# EAGLE design mother_card_17 (EAGLE 8.3.2)

## Sheet 1 of 2
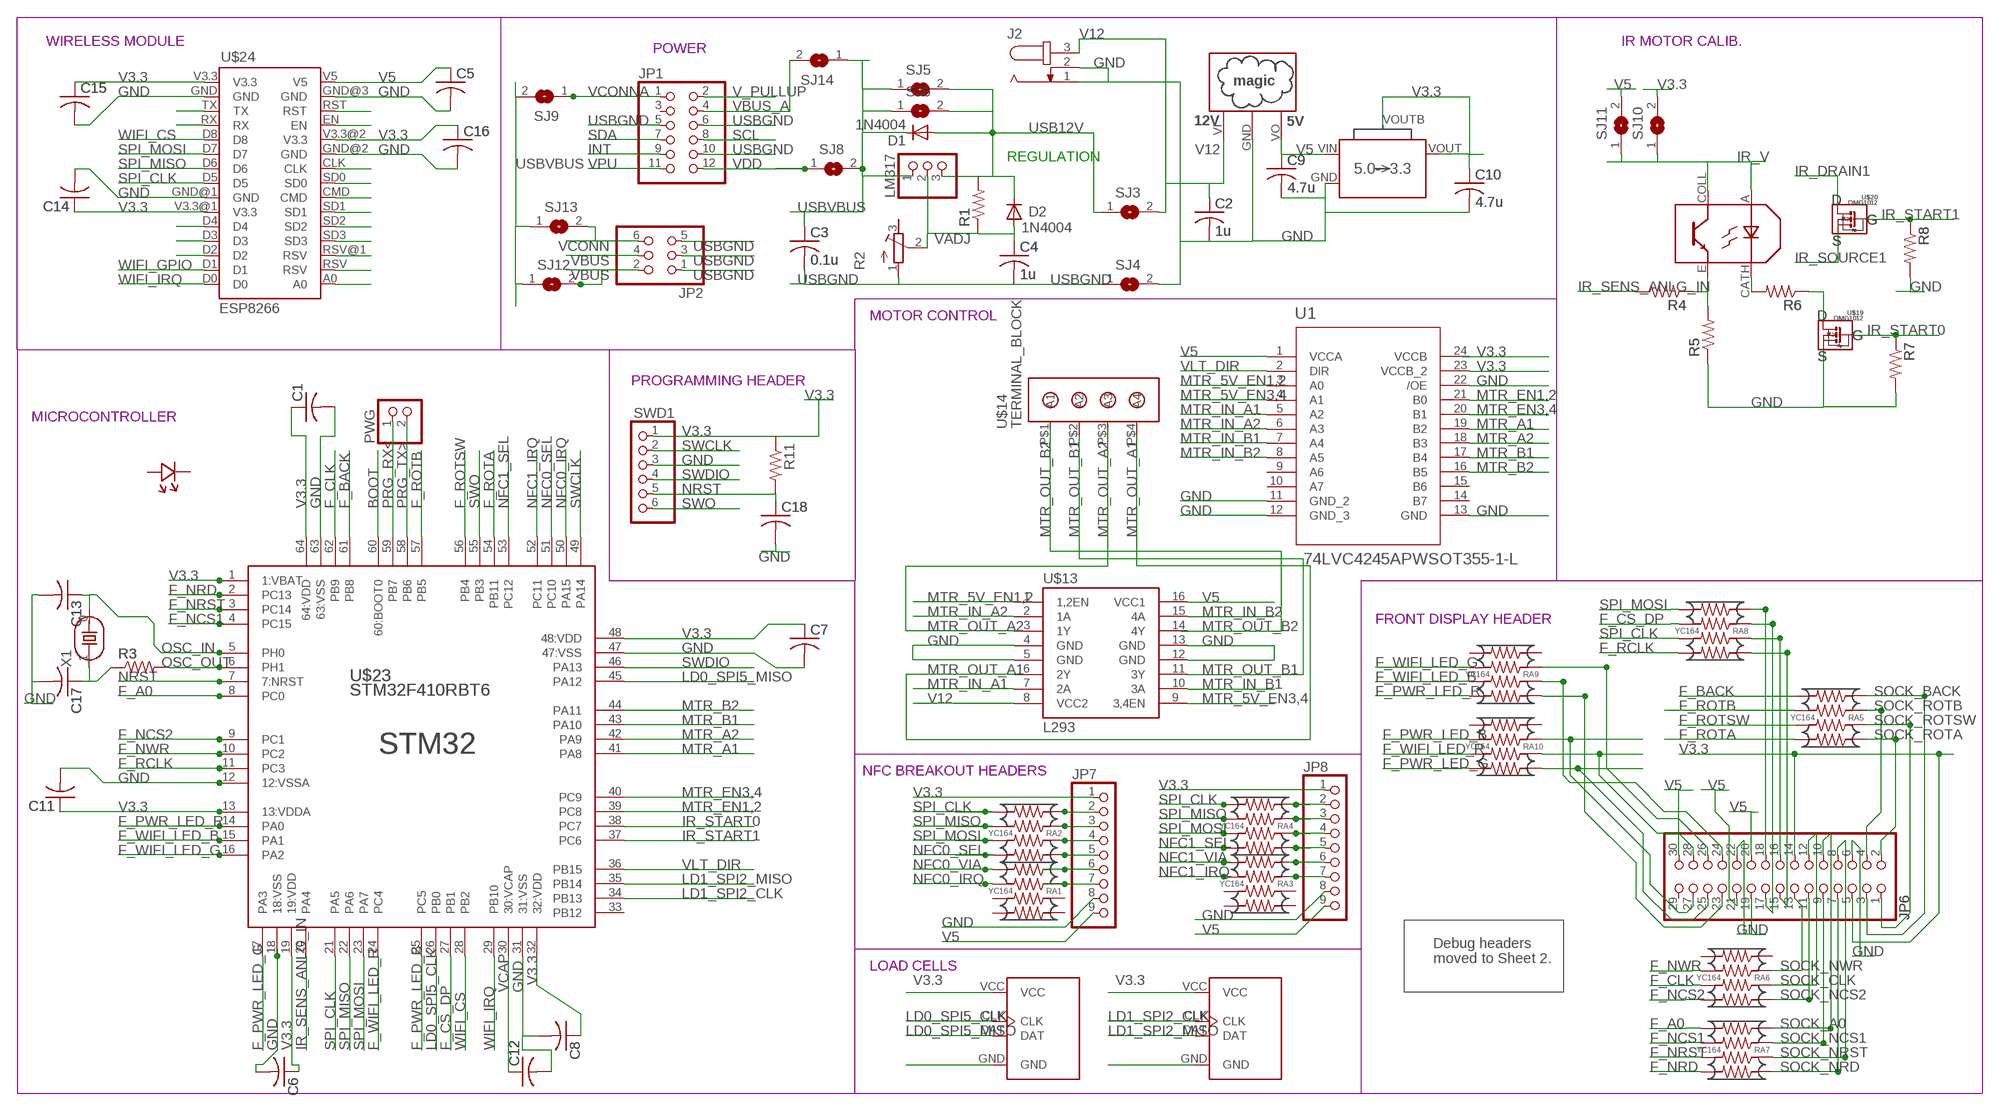
[diagram p0: schematic, sheet 1]

### Parts
C1  C-USC0805  [C0805]
C2  1u  C-USC0805  [C0805]
C3  0.1u  C-USC0805  [C0805]
C4  1u  C-USC0805  [C0805]
C5  C-USC0805  [C0805]
C6  C-USC0805  [C0805]
C7  C-USC0805  [C0805]
C8  C-USC0805  [C0805]
C9  4.7u  C-USC0805  [C0805]
C10  4.7u  C-USC0805  [C0805]
C11  C-USC0805  [C0805]
C12  C-USC0805  [C0805]
C13  C-USC0603  [C0603]
C14  C-USC0805  [C0805]
C15  C-USC0805  [C0805]
C16  C-USC0805  [C0805]
C17  C-USC0603  [C0603]
C18  C-USC0805  [C0805]
D1  1N4004  [DO41-10]
D2  1N4004  [DO41-10]
J2  JACK-PLUG0  [SPC4077]
JP1  PINHD-2X6  [2X06]
JP2  PINHD-2X3  [2X03]
JP6  PINHD-2X15/SOCK  [2X15/SOCK]
JP7  PINHD-1X9/90  [1X09/90]
JP8  PINHD-1X9/90  [1X09/90]
LM317  PINHD-1X3  [1X03]
PWG  PINHD-1X2  [1X02]
R1  R-US_R0805  [R0805]
R2  R-TRIMM64W  [RTRIM64W]
R3  R-US_R0805  [R0805]
R4  R-US_R0805  [R0805]
R5  R-US_R0805  [R0805]
R6  R-US_R0805  [R0805]
R7  R-US_R0805  [R0805]
R8  R-US_R0805  [R0805]
R11  R-US_R0805  [R0805]
RA1  YC164  [YC164]
RA2  YC164  [YC164]
RA3  YC164  [YC164]
RA4  YC164  [YC164]
RA5  YC164  [YC164]
RA6  YC164  [YC164]
RA7  YC164  [YC164]
RA8  YC164  [YC164]
RA9  YC164  [YC164]
RA10  YC164  [YC164]
SJ3  SJ  [SJ]
SJ4  SJ  [SJ]
SJ5  SJ  [SJ]
SJ6  SJ  [SJ]
SJ8  SJ  [SJ]
SJ9  SJ  [SJ]
SJ10  SJ  [SJ]
SJ11  SJ  [SJ]
SJ12  SJ  [SJ]
SJ13  SJ  [SJ]
SJ14  SJ  [SJ]
SWD1  PINHD-1X6  [1X06]
U1  74LVC4245APWSOT355-1-L  [SOT355-1-L]
U$12  LED0603  [LED]
U$13  L293  [DIL16]
U$14  TERMINAL_BLOCK  [1X4/BLOCK]
U$15  AP2114H  [AP2114H]
U$16  OKI-78SR-W36  [SIP3]
U$18  TCRT5000  [TCRT5000]
U$19  DMG1012  [SOT323]
U$20  DMG1012  [SOT323]
U$21  HX711  [HX711]
U$22  HX711  [HX711]
U$23  STM32F410RBT6  [QFP50P1200X1200X160-64N]
U$24  ESP8266  [ESP8266]
X1  HC-49S_9B  [HC-49S_9B]

### Nets
BOOT: U$23.60(60:BOOT0)
F_A0: RA7.P$4 U$23.8(PC0) ; also sheet 2
F_BACK: RA5.P$4 U$23.61(PB8) ; also sheet 2
F_CLK: RA6.P$2 U$23.62(PB9) ; also sheet 2
F_CS_DP: RA8.P$3 U$23.27(PB1) ; also sheet 2
F_NCS1: RA7.P$3 U$23.4(PC15) ; also sheet 2
F_NCS2: RA6.P$1 U$23.9(PC1) ; also sheet 2
F_NRD: RA7.P$1 U$23.2(PC13) ; also sheet 2
F_NRST: RA7.P$2 U$23.3(PC14) ; also sheet 2
F_NWR: RA6.P$3 U$23.10(PC2) ; also sheet 2
F_PWR_LED_B: RA10.P$3 U$23.25(PC5) ; also sheet 2
F_PWR_LED_G: RA10.P$1 U$23.17(PA3) ; also sheet 2
F_PWR_LED_R: RA9.P$1 U$23.14(PA0) ; also sheet 2
F_RCLK: RA8.P$1 U$23.11(PC3) ; also sheet 2
F_ROTA: RA5.P$1 U$23.54(PB11) ; also sheet 2
F_ROTB: RA5.P$3 U$23.57(PB5) ; also sheet 2
F_ROTSW: RA5.P$2 U$23.56(PB4) ; also sheet 2
F_WIFI_LED_B: RA9.P$2 U$23.15(PA1) ; also sheet 2
F_WIFI_LED_G: RA9.P$3 U$23.16(PA2) ; also sheet 2
F_WIFI_LED_R: RA10.P$2 U$23.24(PC4) ; also sheet 2
GND: C1.2 C2.2 C5.2 C6.2 C7.2 C8.2 C9.2 C10.2 C11.2 C12.2 C13.2 C14.2 C15.2 C16.2 C17.2 C18.2 J2.1 J2.2 JP6.6 JP6.19 JP6.22 JP7.8 JP8.8 R5.1 R7.2 R8.2 SJ4.2 SWD1.3 U1.11(GND_2) U1.12(GND_3) U1.13(GND) U1.22(/OE) U$13.4(GND) U$13.5(GND) U$13.12(GND) U$13.13(GND) U$15.GND U$16.GND U$19.S U$21.GND U$22.GND U$23.12(12:VSSA) U$23.18(18:VSS) U$23.31(31:VSS) U$23.47(47:VSS) U$23.63(63:VSS) U$24.GND U$24.GND@1(GND) U$24.GND@2(GND) U$24.GND@3(GND) ; also sheet 2
INT: JP1.9
IR_DRAIN1: U$20.D
IR_SENS_ANLG_IN: R4.2 U$23.20(PA4)
IR_SOURCE1: U$20.S
IR_START0: R7.1 U$19.G U$23.38(PC7)
IR_START1: R8.1 U$20.G U$23.37(PC6)
IR_V: SJ10.1 SJ11.1 U$18.A U$18.COLL
LD0_SPI5_CLK: U$21.CLK U$23.26(PB0)
LD0_SPI5_MISO: U$21.DAT U$23.45(PA12)
LD1_SPI2_CLK: U$22.CLK U$23.34(PB13)
LD1_SPI2_MISO: U$22.DAT U$23.35(PB14)
MTR_5V_EN1,2: U1.3(A0) U$13.1(1,2EN)
MTR_5V_EN3,4: U1.4(A1) U$13.9(3,4EN)
MTR_A1: U1.19(B2) U$23.41(PA8)
MTR_A2: U1.18(B3) U$23.42(PA9)
MTR_B1: U1.17(B4) U$23.43(PA10)
MTR_B2: U1.16(B5) U$23.44(PA11)
MTR_EN1,2: U1.21(B0) U$23.39(PC8)
MTR_EN3,4: U1.20(B1) U$23.40(PC9)
MTR_IN_A1: U1.5(A2) U$13.7(2A)
MTR_IN_A2: U1.6(A3) U$13.2(1A)
MTR_IN_B1: U1.7(A4) U$13.10(3A)
MTR_IN_B2: U1.8(A5) U$13.15(4A)
MTR_OUT_A1: U$13.6(2Y) U$14.P$4(A4)
MTR_OUT_A2: U$13.3(1Y) U$14.P$3(A3)
MTR_OUT_B1: U$13.11(3Y) U$14.P$2(A2)
MTR_OUT_B2: U$13.14(4Y) U$14.P$1(A1)
N$1: U$24.A0
N$2: JP7.6 RA1.P$44
N$4: JP8.6 RA3.P$44
N$5: R6.2 U$18.CATH
N$8: R3.2 U$23.6(PH1)
N$9: U$24.RSV
N$10: R6.1 U$19.D
N$13: U$24.RSV@1(RSV)
N$14: U$24.SD3
N$15: U$24.SD2
N$16: U$24.SD1
N$23: U$24.CMD
N$24: U$24.SD0
N$25: U$24.CLK
N$26: U$24.D2
N$27: U$24.D3
N$28: U$24.D4
N$29: U$24.RX
N$30: U$24.TX
N$31: U$24.EN
N$32: U$24.RST
N$33: JP8.2 RA4.P$44
N$36: JP8.3 RA4.P$33
N$37: JP8.4 RA4.P$22
N$38: JP8.5 RA4.P$11
N$39: JP8.7 RA3.P$33
N$40: JP7.5 RA2.P$11
N$41: JP7.4 RA2.P$22
N$42: JP7.3 RA2.P$33
N$43: JP7.2 RA2.P$44
N$44: JP7.7 RA1.P$33
N$45: R4.1 R5.2 U$18.E
NFC0_IRQ: RA1.P$3 U$23.50(PA15)
NFC0_SEL: RA2.P$1 U$23.51(PC10)
NFC0_VIA: RA1.P$4
NFC1_IRQ: RA3.P$3 U$23.52(PC11)
NFC1_SEL: RA4.P$1 U$23.53(PC12)
NFC1_VIA: RA3.P$4
NRST: C18.1 R11.2 SWD1.5 U$23.7(7:NRST)
OSC_IN: C13.1 U$23.5(PH0) X1.0
OSC_OUT: C17.1 R3.1 X1.1
PRG_RX<: PWG.1 U$23.59(PB7)
PRG_TX>: PWG.2 U$23.58(PB6)
SCL: JP1.8
SDA: JP1.7
SOCK__CS_DP: JP6.17 RA8.P$33
SOCK__RCLK: JP6.15 RA8.P$11
SOCK_A0: JP6.10 RA7.P$44
SOCK_BACK: JP6.3 RA5.P$44
SOCK_CLK: JP6.12 RA6.P$22
SOCK_NCS1: JP6.9 RA7.P$33
SOCK_NCS2: JP6.11 RA6.P$11
SOCK_NRD: JP6.7 RA7.P$11
SOCK_NRST: JP6.8 RA7.P$22
SOCK_NWR: JP6.13 RA6.P$33
SOCK_PWR_LED_B: JP6.27 RA10.P$33
SOCK_PWR_LED_G: JP6.25 RA10.P$11
SOCK_PWR_LED_R: JP6.23 RA9.P$11
SOCK_ROTA: JP6.2 RA5.P$11
SOCK_ROTB: JP6.4 RA5.P$33
SOCK_ROTSW: JP6.1 RA5.P$22
SOCK_SPI_CLK: JP6.16 RA8.P$22
SOCK_SPI_MOSI: JP6.18 RA8.P$44
SOCK_WIFI_LED_B: JP6.24 RA9.P$22
SOCK_WIFI_LED_G: JP6.26 RA9.P$33
SOCK_WIFI_LED_R: JP6.28 RA10.P$22
SPI_CLK: RA2.P$4 RA4.P$4 RA8.P$2 U$23.21(PA5) U$24.D5 ; also sheet 2
SPI_MISO: RA2.P$3 RA4.P$3 U$23.22(PA6) U$24.D6
SPI_MOSI: RA2.P$2 RA4.P$2 RA8.P$4 U$23.23(PA7) U$24.D7 ; also sheet 2
SWCLK: SWD1.2 U$23.49(PA14)
SWDIO: SWD1.4 U$23.46(PA13)
SWO: SWD1.6 U$23.55(PB3)
USB12V: D1.A D2.C LM317.3 R1.2 SJ3.1 SJ5.2 SJ6.2
USBGND: C3.2 C4.2 JP1.5 JP1.6 JP1.10 JP2.1 JP2.3 JP2.5 R2.1(A) SJ4.1 ; also sheet 2
USBVBUS: C3.1 D1.C LM317.1 SJ5.1 SJ6.1 SJ8.2 SJ9.2 SJ12.1 SJ13.1 SJ14.1
V3.3: C1.1 C6.1 C7.1 C8.1 C10.1 C11.1 C14.1 C15.1 C16.1 JP6.5 JP6.14 JP7.1 JP8.1 R11.1 SJ10.2 SWD1.1 U1.23(VCCB_2) U1.24(VCCB) U$15.VOUT(VO) U$15.VOUTB(BODY) U$21.VCC U$22.VCC U$23.1(1:VBAT) U$23.13(13:VDDA) U$23.19(19:VDD) U$23.32(32:VDD) U$23.48(48:VDD) U$23.64(64:VDD) U$24.V3.3 U$24.V3.3@1(V3.3) U$24.V3.3@2(V3.3)
V5: C5.1 C9.1 JP6.20 JP6.21 JP6.30 JP7.9 JP8.9 SJ11.2 U1.1(VCCA) U$13.16(VCC1) U$15.VIN(VI) U$16.VO U$24.V5
V12: C2.1 J2.3 SJ3.2 U$13.8(VCC2) U$16.VI
V_PULLUP: JP1.2
VADJ: C4.1 D2.A LM317.2 R1.1 R2.2(S)
VBUS: JP2.2 JP2.4 SJ12.2
VBUS_A: JP1.4 SJ14.2
VCAP: C12.1 U$23.30(30:VCAP)
VCONN: JP2.6 SJ13.2
VCONNA: JP1.1 SJ9.1
VDD: JP1.12 SJ8.1
VLT_DIR: U1.2(DIR) U$23.36(PB15)
VPU: JP1.11
WIFI_CS: U$23.28(PB2) U$24.D8
WIFI_GPIO: U$24.D1
WIFI_IRQ: U$23.29(PB10) U$24.D0
Unconnected: JP1.3 JP6.29 R2.3(E) RA1.P$1 RA1.P$2 RA1.P$11 RA1.P$22 RA3.P$1 RA3.P$2 RA3.P$11 RA3.P$22 RA6.P$4 RA6.P$44 RA9.P$4 RA9.P$44 RA10.P$4 RA10.P$44 U1.9(A6) U1.10(A7) U1.14(B7) U1.15(B6) U$12.ANODE(AN) U$12.CATHODE(CA) U$23.33(PB12)

### Notes on the sheet
- WIRELESS MODULE | IR MOTOR CALIB.
- POWER
- REGULATION
- MOTOR CONTROL
- PROGRAMMING HEADER
- MICROCONTROLLER
- FRONT DISPLAY HEADER
- NFC BREAKOUT HEADERS
- Debug headers 
  moved to Sheet 2.
- LOAD CELLS

## Sheet 2 of 2
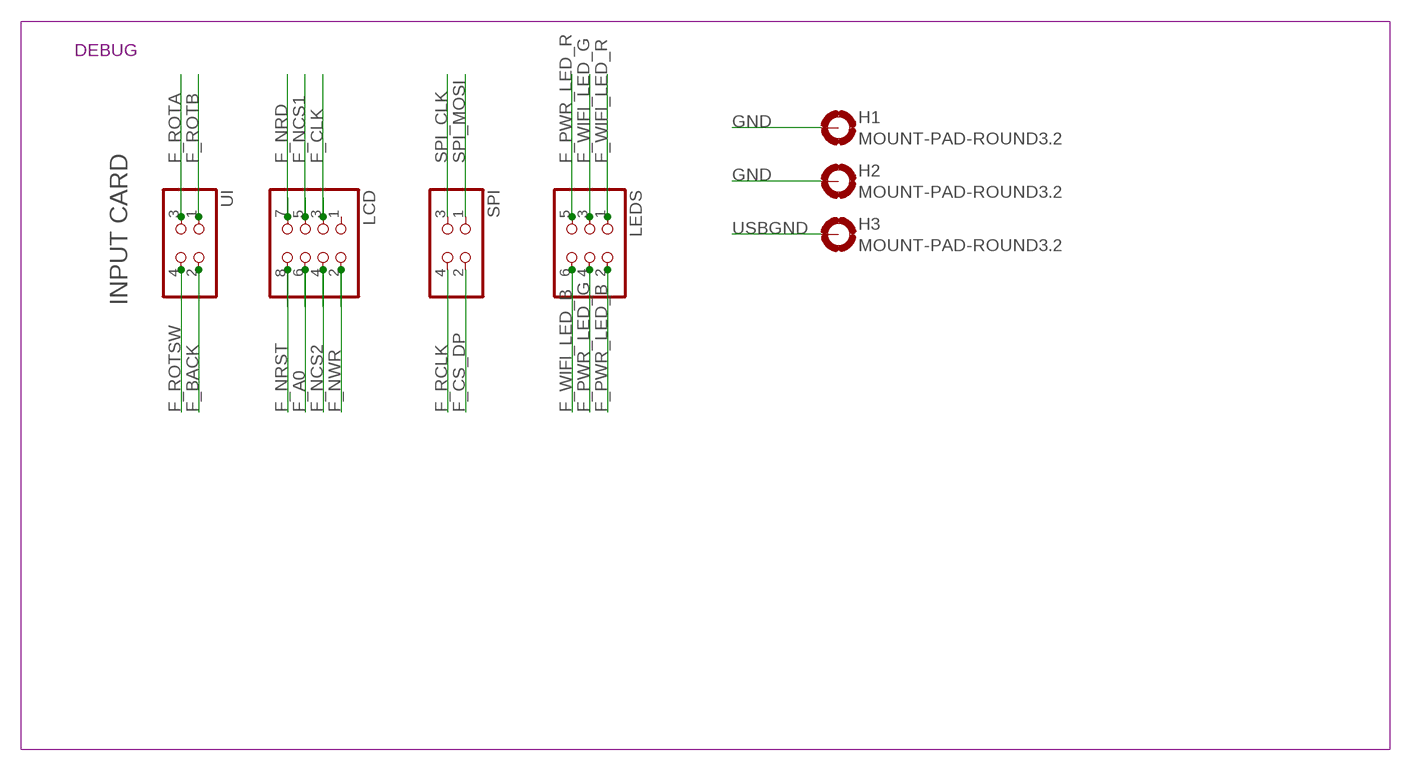
[diagram p1: schematic, sheet 2]

### Parts
H1  MOUNT-PAD-ROUND3.2  [3,2-PAD]
H2  MOUNT-PAD-ROUND3.2  [3,2-PAD]
H3  MOUNT-PAD-ROUND3.2  [3,2-PAD]
LCD  PINHD-2X4  [2X04]
LEDS  PINHD-2X3  [2X03]
SPI  PINHD-2X2  [2X02]
UI  PINHD-2X2  [2X02]

### Nets
F_A0: LCD.6 ; also sheet 1
F_BACK: UI.2 ; also sheet 1
F_CLK: LCD.3 ; also sheet 1
F_CS_DP: SPI.2 ; also sheet 1
F_NCS1: LCD.5 ; also sheet 1
F_NCS2: LCD.4 ; also sheet 1
F_NRD: LCD.7 ; also sheet 1
F_NRST: LCD.8 ; also sheet 1
F_NWR: LCD.2 ; also sheet 1
F_PWR_LED_B: LEDS.2 ; also sheet 1
F_PWR_LED_G: LEDS.4 ; also sheet 1
F_PWR_LED_R: LEDS.5 ; also sheet 1
F_RCLK: SPI.4 ; also sheet 1
F_ROTA: UI.3 ; also sheet 1
F_ROTB: UI.1 ; also sheet 1
F_ROTSW: UI.4 ; also sheet 1
F_WIFI_LED_B: LEDS.6 ; also sheet 1
F_WIFI_LED_G: LEDS.3 ; also sheet 1
F_WIFI_LED_R: LEDS.1 ; also sheet 1
GND: H1.B3,2(MOUNT) H2.B3,2(MOUNT) ; also sheet 1
SPI_CLK: SPI.3 ; also sheet 1
SPI_MOSI: SPI.1 ; also sheet 1
USBGND: H3.B3,2(MOUNT) ; also sheet 1
Unconnected: LCD.1

### Notes on the sheet
- DEBUG
- INPUT CARD

## Library data of the parts
C1-C18 = seniorDesign:C-US: CAPACITOR, American symbol
D1 D2 = diode:1N4004: DIODE general purpose rectifier, 1 A
H1-H3 = holes:MOUNT-PAD-ROUND: MOUNTING PAD, round
J2 = con-jack:JACK-PLUG: DC POWER JACK Power Jack, DC, Right Angle, Through Hole, Rated 5A at 16VDC, PC Terminals Distributor: Farnell (www.Farnell.de) Drawing: 84N1161.pdf / 84N1162.pdf Manufacturer: SPC Technology (www.spctechnology.com) Type: SPC4077 / SPC 4078; OC_FARNELL: unknown; OC_NEWARK: unknown
JP1 = pinhead:PINHD-2X6: PIN HEADER
JP2 LEDS = pinhead:PINHD-2X3: PIN HEADER
JP6 = seniorDesign:PINHD-2X15: PIN HEADER, socket for parallel cable, IDC connector, On Shore Technology Inc.
JP7 JP8 = pinhead:PINHD-1X9: PIN HEADER
LCD = pinhead:PINHD-2X4: PIN HEADER
LM317 = pinhead:PINHD-1X3: PIN HEADER
PWG = pinhead:PINHD-1X2: PIN HEADER
R1 R3-R8 = seniorDesign:R-US_: RESISTOR, American symbol
R2 = rcl:R-TRIMM: Trimm resistor
R11 = resistor:R-US_: RESISTOR, American symbol
RA1-RA10 = seniorDesign:YC164: Yageo Resistor Array motherboard serial resistance for cables headed offboard
SJ3-SJ6 SJ8-SJ14 = jumper:SJ: SMD solder JUMPER
SPI UI = pinhead:PINHD-2X2: PIN HEADER
SWD1 = pinhead:PINHD-1X6: PIN HEADER
U1 = seniorDesign:74LVC4245APW: Level Translator input board; MANUFACTURER_PART_NUMBER: 74LVC4245APW; VENDOR: NXP
U$12 = seniorDesign:LED0603: Heartbeat LED 0603
U$13 = seniorDesign:L293: L293 Stepper Motor Driver
U$14 = seniorDesign:TERMINAL_BLOCK: Terminal Block for stepper motor connections
U$15 = seniorDesign:AP2114: AP2114H-3.3TRG1DICT-ND 5V LDO, main 5V line, motherboard https://www.diodes.com/assets/Datasheets/AP2114.pdf
U$16 = seniorDesign:OKI-78SR-W36
U$18 = seniorDesign:TCRT5000: Vishay Semiconductor Opto Division TCRT5000 mother board cover repositioning http://www.vishay.com/docs/83760/tcrt5000.pdf
U$19 U$20 = seniorDesign:DMG1012: DMG1012UW-7DICT-ND https://www.diodes.com/assets/Datasheets/ds31859.pdf Vt ~= 1.25V, IDS ~= 0.900 A, [VGS = (3.3 - 0.7)V, VDS = 0V]
U$21 U$22 = seniorDesign:HX711: old green circuit board rendition of HX711 load amplifier
U$23 = seniorDesign:STM32F410RBT6: STMicroelectronics STM32F410RBT6 main microcontroller, motherboard http://www.st.com/.../content/translations/en.DM00214043.pdf <http://www.st.com/content/ccc/resource/technical/document/datasheet/6e/f3/b0/1b/05/eb/49/fe/DM00214043.pdf/files/DM00214043.pdf/jcr:content/translations/en.DM00214043.pdf>
U$24 = seniorDesign:ESP8266: ESP8266 Wifi Module Breakout
X1 = seniorDesign:HC-49S_9B: TXC CORPORATION 9B-25.000MBBK-B motherboard stm32 HSE external clock reference http://www.txccorp.com/download/products/quartz_crystals/2015TXC_9B_33.pdf

## Board
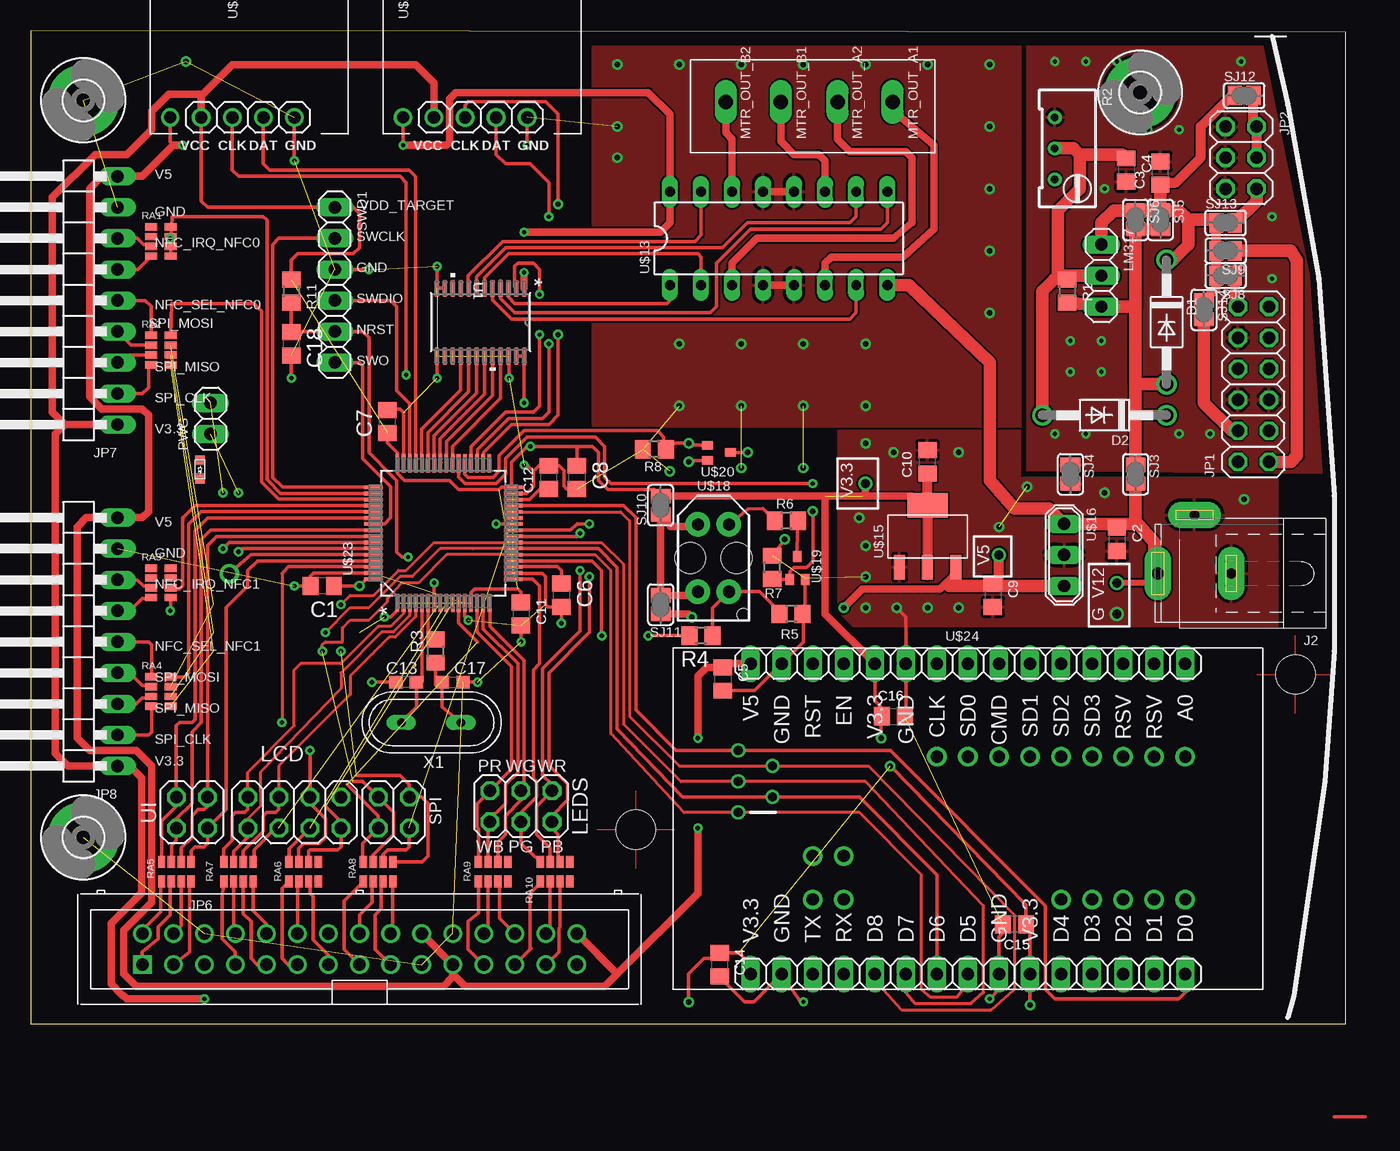
[diagram p2: board, top side]
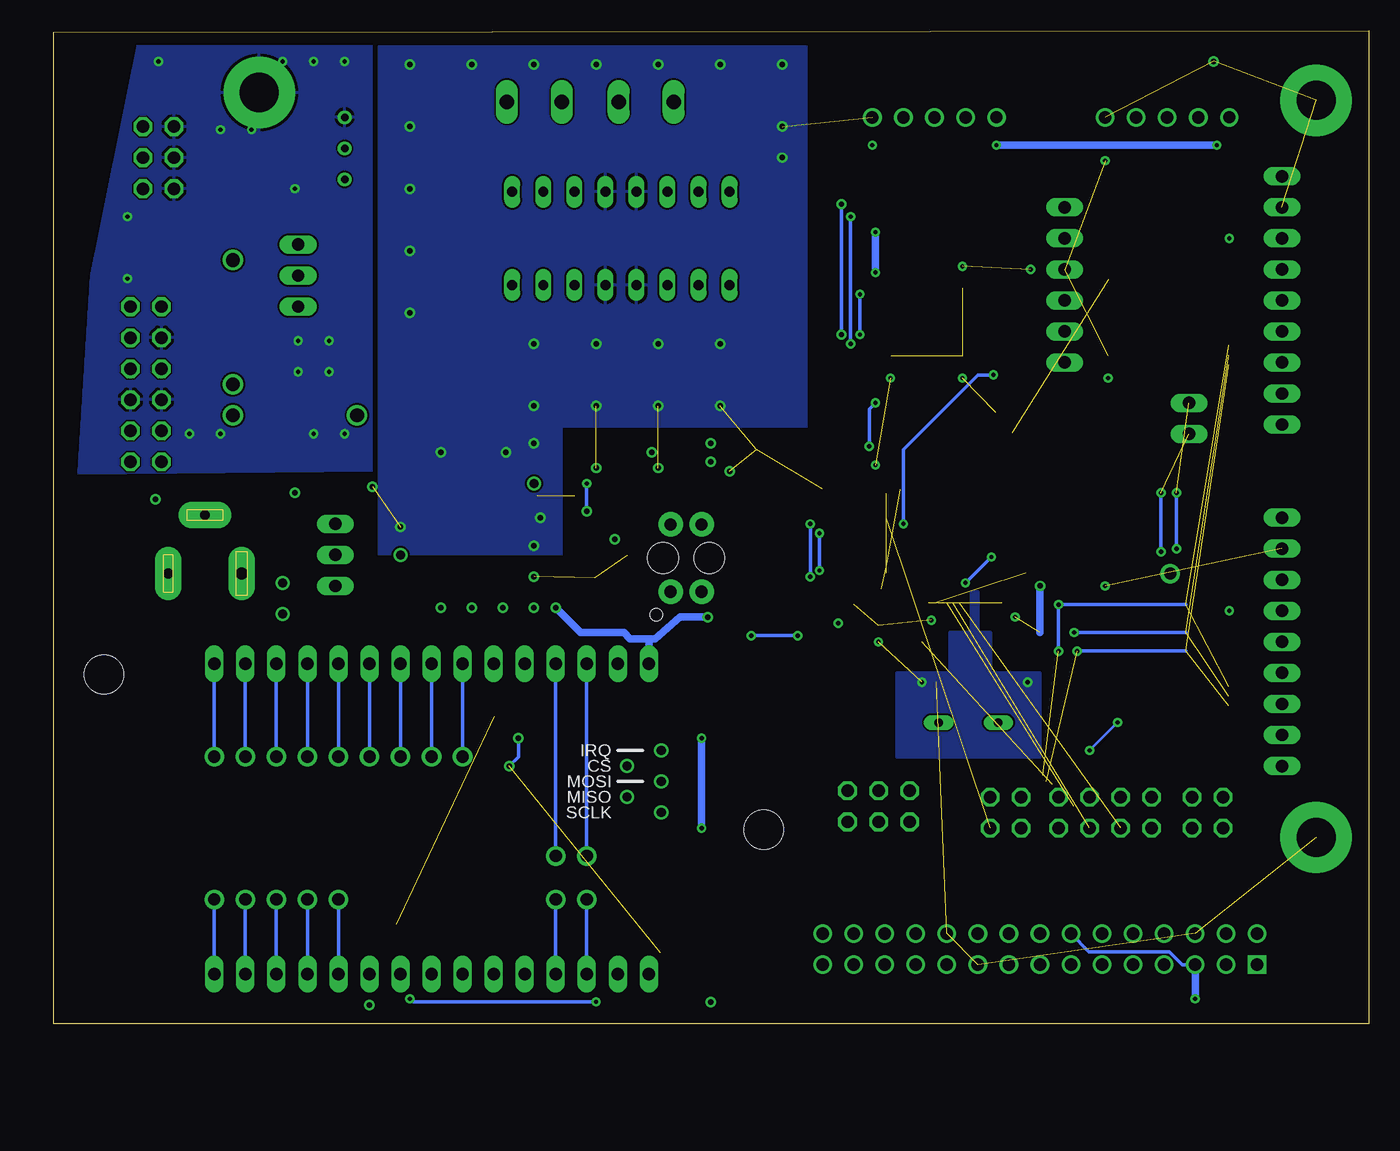
[diagram p3: board, bottom side, seen from below]

Size 107.62 x 81.27 mm. Coordinates in mm from the lower left corner, seen from the top.
Outline: 0,0 107.62,0 107.62,81.14 0,81.27 0,0
Copper layers (1*16): Top 0.035mm / dielectric 1.5mm / Bottom 0.035mm
Design rules "default": minimum track width 6mil, minimum drill 0.35mm, track to track 6mil, track to pad 6mil, pad to pad 6mil, via to via 6mil, smd to smd 6mil, copper to edge 40mil, drill to drill 6mil, minimum pad ring 10mil, minimum via ring 8mil, stop-mask expansion 4mil, vias tented up to drill 0mil, thermal gap 10mil
Holes 3.2 mm at 103.5,28.57 49.53,15.88

### Footprints (pad centres in the part's own frame; a part is rotated, then mirrored left to right if it is on the bottom)
C0805 = smd 1.3 x 1.5: 1 -0.95,0; 2 0.95,0
C0603 = smd 1.1 x 1: 1 -0.85,0; 2 0.85,0
DO41-10 = drill 1.118: A 5.08,0; C -5.08,0
3,2-PAD = drill 3.2 pad 5.842: B3,2 0,0
SPC4077 = drill 0.8 pad 2.184 long: 1 -3,0; 2 0,-4.8 | drill 1 pad 2.184 long: 3 3,0
2X06 = drill 1.016 octagon: 1 -6.35,-1.27; 2 -6.35,1.27; 3 -3.81,-1.27; 4 -3.81,1.27; 5 -1.27,-1.27; 6 -1.27,1.27; 7 1.27,-1.27; 8 1.27,1.27; 9 3.81,-1.27; 10 3.81,1.27; 11 6.35,-1.27; 12 6.35,1.27
2X03 = drill 1.016 octagon: 1 -2.54,-1.27; 2 -2.54,1.27; 3 0,-1.27; 4 0,1.27; 5 2.54,-1.27; 6 2.54,1.27
2X15/SOCK = drill 1.016 square: 1 -17.78,-1.27 | drill 1.016: 2 -17.78,1.27; 3 -15.24,-1.27; 4 -15.24,1.27; 5 -12.7,-1.27; 6 -12.7,1.27; 7 -10.16,-1.27; 8 -10.16,1.27; 9 -7.62,-1.27; 10 -7.62,1.27; 11 -5.08,-1.27; 12 -5.08,1.27; 13 -2.54,-1.27; 14 -2.54,1.27; 15 0,-1.27; 16 0,1.27; 17 2.54,-1.27; 18 2.54,1.27; 19 5.08,-1.27; 20 5.08,1.27; 21 7.62,-1.27; 22 7.62,1.27; 23 10.16,-1.27; 24 10.16,1.27; 25 12.7,-1.27; 26 12.7,1.27; 27 15.24,-1.27; 28 15.24,1.27; 29 17.78,-1.27; 30 17.78,1.27
1X09/90 = drill 1.016 long: 1 -10.16,-3.81; 2 -7.62,-3.81; 3 -5.08,-3.81; 4 -2.54,-3.81; 5 0,-3.81; 6 2.54,-3.81; 7 5.08,-3.81; 8 7.62,-3.81; 9 10.16,-3.81
2X04 = drill 1.016 octagon: 1 -3.81,-1.27; 2 -3.81,1.27; 3 -1.27,-1.27; 4 -1.27,1.27; 5 1.27,-1.27; 6 1.27,1.27; 7 3.81,-1.27; 8 3.81,1.27
1X03 = drill 1.016 long: 1 -2.54,0; 2 0,0; 3 2.54,0
1X02 = drill 1.016 long: 1 -1.27,0; 2 1.27,0
R0805 = smd 1.3 x 1.5: 1 -0.95,0; 2 0.95,0
RTRIM64W = drill 0.61: 1 1.27,-2.54; 2 1.27,0; 3 1.27,2.54
YC164 = smd 0.6 x 1: P$1 -1.2,0.8; P$2 -0.4,0.8; P$3 0.4,0.8; P$4 1.2,0.8; P$11 -1.2,-0.8; P$22 -0.4,-0.8; P$33 0.4,-0.8; P$44 1.2,-0.8
SJ = smd 1.168 x 1.6: 1 -0.762,0; 2 0.762,0
2X02 = drill 1.016 octagon: 1 -1.27,-1.27; 2 -1.27,1.27; 3 1.27,-1.27; 4 1.27,1.27
1X06 = drill 1.016 long: 1 -6.35,0; 2 -3.81,0; 3 -1.27,0; 4 1.27,0; 5 3.81,0; 6 6.35,0
SOT355-1-L = smd 1.372 x 0.305: 1 -2.769,3.575; 2 -2.769,2.925; 3 -2.769,2.275; 4 -2.769,1.625; 5 -2.769,0.975; 6 -2.769,0.325; 7 -2.769,-0.325; 8 -2.769,-0.975; 9 -2.769,-1.625; 10 -2.769,-2.275; 11 -2.769,-2.925; 12 -2.769,-3.575; 13 2.769,-3.575; 14 2.769,-2.925; 15 2.769,-2.275; 16 2.769,-1.625; 17 2.769,-0.975; 18 2.769,-0.325; 19 2.769,0.325; 20 2.769,0.975; 21 2.769,1.625; 22 2.769,2.275; 23 2.769,2.925; 24 2.769,3.575
LED = smd 0.8 x 0.8: ANODE 0.146,0.63; CATHODE 0.146,-0.87
DIL16 = drill 0.813 long: 1 -8.89,-3.81; 2 -6.35,-3.81; 3 -3.81,-3.81; 4 -1.27,-3.81; 5 1.27,-3.81; 6 3.81,-3.81; 7 6.35,-3.81; 8 8.89,-3.81; 9 8.89,3.81; 10 6.35,3.81; 11 3.81,3.81; 12 1.27,3.81; 13 -1.27,3.81; 14 -3.81,3.81; 15 -6.35,3.81; 16 -8.89,3.81
1X4/BLOCK = drill 1.2 long: P$1 0,0; P$2 4.5,0; P$3 9.15,0; P$4 13.65,0
AP2114H = smd 0.9 x 2: GND -2.3,-2.52; VIN 2.3,-2.52; VOUT 0,-2.52 | smd 3.3 x 2: VOUTB 0,2.53
SIP3 = drill 1.016 long: GND 0,0; VI -2.54,0; VO 2.54,0
TCRT5000 = drill 1 pad 2: A 2.75,1.27; CATH 2.75,-1.27; COLL -2.75,1.27; E -2.75,-1.27 | hole 2.5: 0,1.9; 0,-1.9 | hole 1: -4.65,-2.45
SOT323 = smd 0.7 x 0.9: D 0,0.9; G -0.6,-1; S 0.65,-1
HX711 = drill 1.016: CLK -2.54,1.52; DAT -2.54,4.06; GND -2.54,6.6; VCC -2.54,-1.02
QFP50P1200X1200X160-64N = smd 1.5 x 0.3: 1 -5.715,3.759; 2 -5.715,3.251; 3 -5.715,2.743; 4 -5.715,2.261; 5 -5.715,1.753; 6 -5.715,1.245; 7 -5.715,0.762; 8 -5.715,0.254; 9 -5.715,-0.254; 10 -5.715,-0.762; 11 -5.715,-1.245; 12 -5.715,-1.753; 13 -5.715,-2.261; 14 -5.715,-2.743; 15 -5.715,-3.251; 16 -5.715,-3.759; 33 5.715,-3.759; 34 5.715,-3.251; 35 5.715,-2.743; 36 5.715,-2.261; 37 5.715,-1.753; 38 5.715,-1.245; 39 5.715,-0.762; 40 5.715,-0.254; 41 5.715,0.254; 42 5.715,0.762; 43 5.715,1.245; 44 5.715,1.753; 45 5.715,2.261; 46 5.715,2.743; 47 5.715,3.251; 48 5.715,3.759 | smd 0.3 x 1.5: 17 -3.759,-5.715; 18 -3.251,-5.715; 19 -2.743,-5.715; 20 -2.261,-5.715; 21 -1.753,-5.715; 22 -1.245,-5.715; 23 -0.762,-5.715; 24 -0.254,-5.715; 25 0.254,-5.715; 26 0.762,-5.715; 27 1.245,-5.715; 28 1.753,-5.715; 29 2.261,-5.715; 30 2.743,-5.715; 31 3.251,-5.715; 32 3.759,-5.715; 49 3.759,5.715; 50 3.251,5.715; 51 2.743,5.715; 52 2.261,5.715; 53 1.753,5.715; 54 1.245,5.715; 55 0.762,5.715; 56 0.254,5.715; 57 -0.254,5.715; 58 -0.762,5.715; 59 -1.245,5.715; 60 -1.753,5.715; 61 -2.261,5.715; 62 -2.743,5.715; 63 -3.251,5.715; 64 -3.759,5.715
ESP8266 = drill 1.016 long: A0 19.05,0; CLK -1.27,0; CMD 3.81,0; D0 19.05,-25.4; D1 16.51,-25.4; D2 13.97,-25.4; D3 11.43,-25.4; D4 8.89,-25.4; D5 1.27,-25.4; D6 -1.27,-25.4; D7 -3.81,-25.4; D8 -6.35,-25.4; EN -8.89,0; GND -13.97,-25.4; GND@1 3.81,-25.4; GND@2 -3.81,0; GND@3 -13.97,0; RST -11.43,0; RSV 16.51,0; RSV@1 13.97,0; RX -8.89,-25.4; SD0 1.27,0; SD1 6.35,0; SD2 8.89,0; SD3 11.43,0; TX -11.43,-25.4; V3.3 -16.51,-25.4; V3.3@1 6.35,-25.4; V3.3@2 -6.35,0; V5 -16.51,0
HC-49S_9B = drill 0.7 long: 0 -2.44,0; 1 2.44,0

### Placement (x,y rotation side)
C1  23.88,35.81 180 top
C2  88.9,39.62 270 top
C3  92.46,69.6 90 top
C4  89.66,69.85 270 top
C5  56.64,28.19 270 top
C6  43.43,35.05 270 top
C7  29.21,49.28 90 top
C8  44.7,44.7 270 top
C9  78.74,35.05 270 top
C10  73.41,45.97 90 top
C11  40.13,33.53 270 top
C12  42.42,44.7 90 top
C13  30.73,27.94 180 top
C14  56.39,4.83 270 top
C15  80.52,8.13 180 top
C16  70.61,25.15 0 top
C17  34.54,27.94 0 top
C18  21.34,55.63 270 top
D1  92.96,57.4 270 top
D2  87.88,49.78 180 top
H1  4.32,15.24 0 top
H2  4.32,75.56 0 top
H3  90.81,76.2 0 top
J2  95.25,36.83 180 top
JP1  100.08,52.32 90 top
JP2  99.06,70.87 270 top
JP6  26.92,6.1 0 top
JP7  3.3,59.18 90 top
JP8  3.3,31.24 90 top
LCD  21.59,17.27 180 top
LEDS  40.13,17.78 180 top
LM317  87.63,61.21 270 top
PWG  14.73,49.53 90 top
R1  84.84,59.94 270 top
R2  85.09,71.63 180 top
R3  33.15,30.48 90 top
R4  54.86,31.75 180 top
R5  62.23,33.53 180 top
R6  61.85,41.15 180 top
R7  60.71,37.34 90 top
R8  51.05,46.99 180 top
R11  21.34,59.94 270 top
RA1  10.67,64.01 270 top
RA2  10.67,55.12 270 top
RA3  10.67,36.07 270 top
RA4  10.67,27.18 270 top
RA5  11.94,12.45 0 top
RA6  22.35,12.45 0 top
RA7  17.02,12.45 0 top
RA8  28.45,12.45 0 top
RA9  37.85,12.45 0 top
RA10  42.93,12.45 0 top
SJ3  90.42,44.96 270 top
SJ4  85.09,44.96 270 top
SJ5  92.46,65.79 270 top
SJ6  90.42,65.79 270 top
SJ8  97.79,61.21 180 top
SJ9  97.79,63.25 180 top
SJ10  51.56,42.42 90 top
SJ11  51.56,34.29 270 top
SJ12  99.31,75.95 0 top
SJ13  97.79,65.53 0 top
SJ14  96.01,58.42 270 top
SPI  29.72,17.27 180 top
SWD1  24.89,60.45 270 top
U1  36.83,57.4 270 top
U$12  13.72,45.47 0 top
U$13  61.21,64.26 0 top
U$14  56.9,75.44 0 top
U$15  73.41,39.88 0 top
U$16  84.58,38.35 270 top
U$18  55.88,38.1 90 top
U$19  62.74,37.34 0 top
U$20  56.39,46.74 270 top
U$21  14.99,71.63 270 top
U$22  34.04,71.63 270 top
U$23  33.78,40.13 90 top
U$24  75.44,29.46 0 top
UI  13.21,17.27 180 top
X1  32.77,24.64 0 top

### Tracks (layer width: path | path; a pad name or v marks a point on that pad's centre or on a via)
BOOT  (via drill 1 pad 1.6)
  Top 0.305: U$23.60 18.06,38.38 v16.26,36.83
F_A0  (1 unrouted)
  Top 0.305: LCD.6 20.07,16 18.29,14.22 18.29,13.32 RA7.P$4
F_BACK
  Top 0.305: RA5.P$4 13.14,14.15 13.46,14.48 14.22,14.48 14.48,14.73 UI.2 16,17.53 16,34.04 17.78,35.81 17.78,37.08 18.57,37.87 U$23.61
F_CLK  (via drill 0.35)
  Top 0.254: 20.57,36.83 v20.57,24.64
  Top 0.305: 21.95,13.57 RA6.P$2 21.95,14.33 22.35,14.73 23.62,14.73 24.13,15.24 24.13,16.76 22.86,18.03 LCD.3 v22.86,22.35 | U$23.62 21.13,37.39 20.57,36.83
  Bottom 0.254: v20.57,24.64 v22.86,22.35
F_CS_DP  (1 unrouted)
  Top 0.305: RA8.P$3 28.85,13.86 29.21,14.22 30.73,14.22 30.99,14.48 SPI.2
F_NCS1
  Top 0.254: U$23.4 31.52,33.3 29.85,31.63 29.34,31.63 26.16,28.45 26.16,26.92 20.32,21.08 LCD.5
  Top 0.305: LCD.5 20.32,17.53 20.07,17.27 19.3,17.27 19.05,17.02 19.05,15.75 17.42,14.12 RA7.P$3
F_NCS2  (1 unrouted)
  Top 0.305: RA6.P$1 21.15,14.29 LCD.4
F_NRD
  Top 0.254: LCD.7 17.78,20.57 21.59,24.38 21.59,28.96 22.1,29.46 25.4,29.46 28.45,32.51 29.46,32.51 30.53,33.58 U$23.2
  Top 0.305: RA7.P$1 15.82,14.29 16.51,14.99 16.51,17.02 16.76,17.27 17.53,17.27 17.78,17.53 LCD.7
F_NRST
  Top 0.254: U$23.3 31.04,33.39 29.68,32.04 28.73,32.04 25.4,28.7 25.4,27.43 18.8,20.57 18.8,19 18.82,18.97 18.82,17.8 17.78,16.76 17.78,15.75
  Top 0.305: RA7.P$2 16.62,14.08 17.78,15.24 17.78,15.75 LCD.8
F_NWR  (1 unrouted)
  Top 0.305: RA6.P$3 22.75,14.12 22.86,14.22 25.15,14.22 25.4,14.48 LCD.2 25.4,16.51 24.13,17.78
F_PWR_LED_B  (via drill 0.35)
  Top 0.305: U$23.25 44.2,40.39 44.7,40.89 v45.72,40.89 | v45.73,36.57 45.73,32 45.72,32 42.42,28.7 42.42,21.13 43.94,19.61 43.94,18.29 42.67,17.02 LEDS.2 42.67,16 43.18,15.49 43.18,13.87 43.18,13.39 RA10.P$3
  Bottom 0.305: v45.72,40.89 v45.72,36.57 v45.73,36.57
F_PWR_LED_G
  Top 0.305: U$23.17 41.1,36.37 41.66,35.81 41.66,29.46 41.15,28.96 41.15,20.07 41.4,19.81 41.4,18.54 40.13,17.27 LEDS.4 40.13,14.73 RA10.P$1
F_PWR_LED_R
  Top 0.305: U$23.14 36.52,32.06 39.37,29.21 39.37,20.83 LEDS.5 36.52,17.98 36.52,16.07 36.65,15.95 RA9.P$1 36.58,13.32
F_RCLK  (1 unrouted)
  Top 0.305: RA8.P$1 27.18,13.32 27.18,14.73 SPI.4 28.45,17.02 25.91,19.56 | U$23.11 35.03,32.79 36.58,31.24
F_ROTA
  Top 0.305: U$23.54 14.48,41.38 13.46,40.36 13.46,24.89 13.21,24.64 12.19,24.64 11.94,24.38 UI.3 11.94,17.78 10.74,16.58 RA5.P$1
F_ROTB
  Top 0.305: 12.19,13.1 RA5.P$3 12.34,14.37 13.21,15.24 13.21,17.02 13.72,17.53 14.22,17.53 14.48,17.78 UI.1 14.48,39.12 15.24,39.88 U$23.57
F_ROTSW
  Top 0.305: 11.43,13.35 RA5.P$2 11.54,14.59 11.94,14.99 UI.4 11.94,16.76 13.21,18.03 13.21,23.88 13.97,24.64 13.97,39.62 14.73,40.39 U$23.56
F_WIFI_LED_B
  Top 0.305: U$23.15 37.03,32.31 39.88,29.46 39.88,20.57 38.86,19.56 38.86,18.03 37.34,16.51 LEDS.6 37.45,16.36 RA9.P$2 37.34,13.35
F_WIFI_LED_G
  Top 0.305: U$23.16 37.59,34.37 37.59,32.51 40.39,29.72 40.39,19.56 40.13,19.3 LEDS.3 40.13,18.29 38.86,17.02 38.86,15.49 38.25,14.88 RA9.P$3
F_WIFI_LED_R  (via drill 0.35)
  Top 0.305: U$23.24 44.7,39.88 v44.96,40.13 | v44.96,37.08 44.96,32.12 41.91,29.07 41.91,20.32 42.67,19.56 LEDS.1 41.4,17.78 41.4,15.49 42.53,14.37 RA10.P$2
  Bottom 0.305: v44.96,40.13 v44.96,37.08
GND  (via drill 0.35, 0.45, 0.75)  (30 unrouted)
  Top 0.305: 63.39,36.46 U$19.S 63.39,33.6 63.25,33.46 | C14.2 56.39,3.81 58.42,1.78 59.18,1.78 U$24.GND 62.99,1.78 v63.25,1.78 | C5.2 59.25,27.24 U$24.GND@3 63.25,31.24 63.25,33.46 | R7.2 61.53,39.37 v61.72,39.62 | C16.2 71.63,25.21 U$24.GND@2 71.63,33.27 v70.87,34.04 | C15.2 79.57,7.43 79.25,7.11 U$24.GND@1 79.25,2.79 v78.49,2.03 | C8.2 43.88,43.75 43.65,43.98 43.65,45.25 43.25,45.65 C12.2 42.35,45.72 41.66,45.72 41.15,45.21 | U$23.31 40.59,43.38 41.15,43.94 41.15,45.21 | 41.15,45.21 40.64,45.72 v40.39,45.72 | U$23.63 23.16,36.88 22.86,36.58 22.86,35.63 C1.2 v21.59,35.81 | 63.25,33.46 R5.1 | U$23.18 39.55,36.83 41.91,36.83 42.16,36.58 42.16,34.29 42.35,34.1 C6.2 v43.43,32.77 | U$22.GND v40.64,71.89 v40.64,71.88 | U1.22 39.16,54.58 v39.16,52.83 | U1.13 33.27,54.62 v33.27,52.83 | U1.12 33.27,60.19 | 33.27,60.19 v33.27,61.98 | 33.27,60.19 33.29,60.17 U1.11 | C18.2 v21.34,52.83 | U$23.12 35.54,33.3 v35.81,33.02 | U$21.GND v21.59,70.62 v21.59,70.61 | U$23.47 30.53,49.99 30.23,50.29 29.28,50.29 C7.2 | SWD1.3 v27.69,61.72 | C13.2 v27.94,27.94 | C17.2 v36.58,27.94 | v40.13,31.24 C11.2
  Top 0.61: U$13.4 U$13.5 | U$13.13 U$13.12
  Bottom 0.305: v78.49,2.03 78.23,1.78 v63.25,1.78
  other vias: 75.95,46.74 70.61,46.74 99.31,42.93 68.33,47.5 67.82,41.4 68.33,39.12 68.33,36.58 68.33,34.04 73.41,34.04 75.95,34.04 79.25,40.64 68.33,50.55 63.25,50.55 58.17,50.55 53.09,50.55 48.01,70.87 48.01,73.41 48.01,78.49 53.09,78.49 58.17,78.49 63.25,78.49 68.33,78.49 73.41,78.49 78.49,78.49 78.49,73.41 78.49,68.33 78.49,63.25 78.49,58.17 68.33,55.63 63.25,55.63 58.17,55.63 53.09,55.63 12.7,78.74 52.32,45.21 58.17,45.47 63.25,45.47 87.88,43.43 81.53,43.94 88.9,33.53
  pour Top: 66.04,48.51 66.04,33.78 67.31,32.51 102.11,32.51 102.11,44.7 81.03,44.7 81.03,48.51
  pour Top: 45.97,80.01 81.03,80.01 81.03,48.77 45.97,48.77
  pour Bottom: 26.92,28.7 26.92,21.84 38.61,21.84 38.61,28.7 34.29,28.7 34.29,32 32.51,32 32.51,35.31 32,35.31 32,32 30.99,32 30.99,28.7
  pour Bottom: 81.03,38.35 81.03,80.01 45.97,80.01 45.97,48.77 66.04,48.77 66.04,38.35
IR_DRAIN1  (via drill 0.45)
  Top 0.305: U$20.D v58.67,46.74
IR_SENS_ANLG_IN  (via drill 0.35)
  Top 0.305: 53.91,31.24 R4.2 v50.55,31.75 | U$23.20 45.95,37.87 46.74,37.08 v46.74,31.75
  Bottom 0.305: v46.74,31.75 v50.55,31.75
IR_SOURCE1  (via drill 0.45)
  Top 0.305: U$20.S 53.96,46.09 v53.85,45.97
IR_START0  (via drill 0.35, 0.45)
  Top 0.254: U$19.G 62.19,36.34
  Top 0.305: R7.1 60.25,36.34 U$19.G 62.14,36.99 62.48,37.34 63.5,37.34 64.01,37.85 v64.01,41.91 | U$23.38 35.03,44.73 35.56,44.2 38.1,44.2 38.86,44.96 38.86,46.23 40.64,48.01 46.23,48.01 46.99,47.24 46.99,44.7 47.5,44.2 v64.01,44.2
  Bottom 0.305: v64.01,41.91 v64.01,44.2
IR_START1  (via drill 0.45)
  Top 0.305: 55.44,47.39 U$20.G 54.01,47.34 v53.85,47.5 52.51,47.5 R8.1 | U$23.37 35.54,44.98 35.81,44.7 37.85,44.7 38.35,45.21 38.35,46.48 40.39,48.51 51.31,48.51 51.82,48.01 51.82,47.18 R8.1 | R8.1 51.82,46.8
IR_V
  Top 0.61: U$18.COLL 54.31,35.05 SJ11.1 SJ10.1 52.35,40.67 54.43,40.67 U$18.A
LD0_SPI5_CLK  (via drill 0.35)
  Top 0.305: U$23.26 v38.1,40.89 | v30.73,53.09 30.73,68.83 30.23,69.34 17.02,69.34 16.51,69.85 U$21.CLK
  Bottom 0.305: v38.1,40.89 38.1,46.99 32,53.09 v30.73,53.09
LD0_SPI5_MISO
  Top 0.305: U$21.DAT 19.05,70.36 19.56,69.85 30.99,69.85 31.52,69.32 U$23.45
LD1_SPI2_CLK  (via drill 0.4)
  Top 0.305: v43.18,56.39 43.18,49.78 42.42,49.02 39.37,49.02 37.08,46.74 37.08,45.9 U$23.34 | v43.18,67.06 43.18,74.42 42.16,75.44 35.81,75.44 35.56,75.18 U$22.CLK
  Bottom 0.305: v43.18,67.06 v43.18,56.39
LD1_SPI2_MISO  (via drill 0.35)
  Top 0.305: U$22.DAT 38.1,71.12 38.86,70.36 40.89,70.36 42.42,68.83 v42.42,66.04 | v42.42,55.63 42.42,50.04 41.91,49.53 39.12,49.53 36.58,46.99 36.58,45.9 U$23.35
  Bottom 0.305: v42.42,66.04 v42.42,55.63
MTR_5V_EN1,2
  Top 0.305: U1.3 39.1,59.45 39.62,58.93 52.07,58.93 52.32,59.18 U$13.1
MTR_5V_EN3,4
  Top 0.305: 38.45,60.81 U1.4 38.45,59.33 39.62,58.17 55.63,58.17 56.13,58.67 56.13,62.23 58.93,65.02 69.6,65.02 70.1,65.53 U$13.9
MTR_A1
  Top 0.305: 33.58,45.9 U$23.41 33.53,47.88 37.15,51.51 U1.19
MTR_A2
  Top 0.305: U1.18 36.51,51.62 33.02,48.13 U$23.42
MTR_B1
  Top 0.305: 32.51,45.87 U$23.43 32.51,45.87 | U1.17 35.85,51.73 32.51,48.39 32.51,45.87
MTR_B2
  Top 0.305: U1.16 35.2,51.84 32,48.64 32,45.87 U$23.44
MTR_EN1,2
  Top 0.305: U$23.39 34.54,47.24 38.48,51.18 38.48,54.61 U1.21
MTR_EN3,4
  Top 0.305: U1.20 37.8,51.39 34.04,47.62 U$23.40
MTR_IN_A1
  Top 0.305: U1.5 37.8,59.22 39.37,57.66 67.06,57.66 67.56,58.17 U$13.7
MTR_IN_A2
  Top 0.305: U1.6 37.15,61.03 39.12,62.99 54.61,62.99 54.86,62.74 U$13.2
MTR_IN_B1
  Top 0.305: U$13.10 67.56,66.04 67.06,65.53 58.67,65.53 56.64,63.5 38.86,63.5 36.51,61.14 U1.7
MTR_IN_B2
  Top 0.305: U1.8 35.81,60.21 35.81,61.21 38.61,64.01 54.36,64.01 54.86,64.52 U$13.15
MTR_OUT_A1
  Top 0.61: U$13.6 65.02,62.23 65.53,62.74 71.37,62.74 73.91,65.02 73.91,71.88 70.55,74.74 U$14.P$4
MTR_OUT_A2
  Top 0.305: 57.4,60.96 U$13.3
  Top 0.61: U$13.3 57.4,62.23 59.44,64.26 70.61,64.26 72.14,65.53 72.14,70.87 71.63,71.37 67.06,71.37 66.04,72.39 U$14.P$3
MTR_OUT_B1
  Top 0.61: U$14.P$2 61.4,72.21 62.48,71.12 64.52,71.12 65.02,70.61 U$13.11
MTR_OUT_B2
  Top 0.61: U$13.14 57.4,72.39 56.9,72.9 U$14.P$1
N$1  (via drill 1 pad 1.6)
  Bottom 0.305: U$24.A0 v94.49,21.84
N$2
  Top 0.305: JP7.6 8.78,61.72 RA1.P$44
N$3
  Top 0.305: 106.68,-7.62 109.22,-7.62
N$4
  Top 0.305: RA3.P$44 9.84,34.76 9.8,34.8 9.14,34.8 8.13,33.78 JP8.6
N$5
  Top 0.305: U$18.CATH 58.7,42.12 59.94,42.15 60.45,41.59 R6.2
N$8
  Top 0.305: U$23.6 32.54,31.2 R3.2
N$9  (via drill 1 pad 1.6)
  Bottom 0.305: U$24.RSV v91.95,21.84
N$10
  Top 0.305: U$19.D 62.74,38.8 R6.1
N$13  (via drill 1 pad 1.6)
  Bottom 0.305: U$24.RSV@1 v89.41,21.84
N$14  (via drill 1 pad 1.6)
  Bottom 0.305: U$24.SD3 v86.87,21.84
N$15  (via drill 1 pad 1.6)
  Bottom 0.305: U$24.SD2 v84.33,21.84
N$16  (via drill 1 pad 1.6)
  Bottom 0.305: U$24.SD1 v81.79,21.84
N$17
  Top 0.076: 49.53,12.7 49.53,19.05
N$18
  Top 0.076: 46.35,15.88 52.7,15.88
N$23  (via drill 1 pad 1.6)
  Bottom 0.305: U$24.CMD v79.25,21.84
N$24  (via drill 1 pad 1.6)
  Bottom 0.305: U$24.SD0 v76.71,21.84
N$25  (via drill 1 pad 1.6)
  Bottom 0.305: U$24.CLK v74.17,21.84
N$26  (via drill 1 pad 1.6)
  Bottom 0.305: U$24.D2 v89.41,10.16
N$27  (via drill 1 pad 1.6)
  Bottom 0.305: U$24.D3 v86.87,10.16
N$28  (via drill 1 pad 1.6)
  Bottom 0.305: U$24.D4 v84.33,10.16
N$29  (via drill 1 pad 1.6)
  Bottom 0.305: U$24.RX v66.55,10.16
N$30  (via drill 1 pad 1.6)
  Bottom 0.305: U$24.TX v64.01,10.16
N$31  (via drill 1 pad 1.6)
  Bottom 0.305: U$24.EN v66.55,13.72
N$32  (via drill 1 pad 1.6)
  Bottom 0.305: U$24.RST v64.01,13.72
N$33
  Top 0.305: JP8.2 9.65,23.62 9.91,23.88 9.91,25.94 RA4.P$44
N$34
  Top 0.076: 103.5,25.4 103.5,31.75
N$35
  Top 0.076: 100.33,28.57 106.68,28.57
N$36
  Top 0.305: JP8.3 8.64,26.16 9.14,26.67 9.76,26.67 RA4.P$33
N$37
  Top 0.305: JP8.4 8.13,28.7 9.14,27.69 9.76,27.69 RA4.P$22
N$38
  Top 0.305: JP8.5 9.65,31.24 9.91,30.99 9.91,28.42 RA4.P$11
N$39
  Top 0.305: RA3.P$33 9.72,35.81 9.24,35.81 8.73,36.32 JP8.7
N$40
  Top 0.305: RA2.P$11 9.87,58.64 9.91,58.67 9.4,59.18 JP7.5
N$41
  Top 0.305: RA2.P$22 8.24,55.52 JP7.4
N$42
  Top 0.305: RA2.P$33 7.73,54.72 JP7.3
N$43
  Top 0.305: JP7.2 9.14,51.56 9.65,52.07 9.65,53.7 RA2.P$44
N$44
  Top 0.305: RA1.P$33 9.72,63.75 9.24,63.75 8.73,64.26 JP7.7
N$45
  Top 0.305: R5.2 61.28,33.72 59.65,35.35 U$18.E 55.81,34.01 R4.1
NFC0_IRQ
  Top 0.305: U$23.50 20.49,43.38 19.35,44.52 19.35,65.73 19.05,66.04 11.58,66.04 RA1.P$3
NFC0_SEL
  Top 0.305: U$23.51 28.02,42.93 20.3,42.93 18.9,44.33 18.9,58.32 18.29,58.93 11.54,58.93 RA2.P$1
NFC0_VIA  (via drill 0.35)
  Top 0.305: RA1.P$4 11.47,64.3 v11.43,64.26
NFC1_IRQ
  Top 0.305: U$23.52 13.46,42.39 12.47,41.4 12.45,41.4 12.45,35.81 12.19,35.56 11.58,35.56 RA3.P$3
NFC1_SEL
  Top 0.305: RA4.P$1 12.63,28.38 12.95,28.7 12.95,40.89 13.97,41.91 28.04,41.91 U$23.53
NFC1_VIA  (via drill 0.35)
  Top 0.305: RA3.P$4 11.47,33.82 v11.43,33.78
NRST  (via drill 0.35)
  Top 0.305: R11.2 C18.1 21.4,56.64 24.64,56.64 | 24.64,56.64 SWD1.5 | v33.02,36.07 U$23.7 | v30.9,38.18 30.4,38.18 29.97,38.61 29.97,44.43 29.57,44.83 29.57,44.86 27.69,46.74 27.69,56.13 27.18,56.64 24.64,56.64
  Bottom 0.305: v33.02,36.07 v30.9,38.18
OSC_IN
  Top 0.305: U$23.5 32.03,27.96 31.58,27.77 | X1.0 31.58,25.9 31.58,27.77 | 31.58,27.77 C13.1
OSC_OUT
  Top 0.305: X1.1 33.69,25.9 C17.1 33.15,27.72 R3.1
PRG_RX<  (via drill 0.35)  (1 unrouted)
  Top 0.254: 28.12,38.94 U$23.59
  Top 0.305: U$23.59 17.3,38.89 v17.02,38.61
  Bottom 0.305: v17.02,38.61 v17.02,43.43
PRG_TX>  (via drill 0.35)  (1 unrouted)
  Top 0.305: U$23.58 16.26,39.37 v15.75,38.86
  Bottom 0.305: v15.75,38.86 v15.75,43.43
SOCK__CS_DP
  Top 0.305: JP6.17 28.19,6.1 28.19,8.89 28.7,9.4 28.7,11.02 28.7,11.5 RA8.P$33
SOCK__RCLK
  Top 0.305: JP6.15 25.65,6.1 25.65,10.05 RA8.P$11
SOCK_A0
  Top 0.305: JP6.10 19.3,8.13 18.22,9.21 RA7.P$44
SOCK_BACK
  Top 0.305: JP6.3 13,5.89 13,11.51 RA5.P$44
SOCK_CLK
  Top 0.305: JP6.12 21.84,11.54 RA6.P$22
SOCK_NCS1
  Top 0.305: JP6.9 18.54,4.83 18.03,5.33 18.03,8.38 17.42,9 RA7.P$33
SOCK_NCS2
  Top 0.305: JP6.11 21.08,4.83 20.57,5.33 20.57,11.07 RA6.P$11
SOCK_NRD
  Top 0.305: RA7.P$11 15.82,11.48 15.7,10.35 15.7,6.92 16.76,5.86 JP6.7
SOCK_NRST
  Top 0.305: RA7.P$22 16.62,7.73 JP6.8
SOCK_NWR
  Top 0.305: JP6.13 24.38,5.59 23.11,6.86 23.11,10.41 22.86,10.67 22.86,11.54 RA6.P$33
SOCK_PWR_LED_B
  Top 0.305: RA10.P$33 43.33,7.97 43.23,7.81 43.23,5.89 JP6.27
SOCK_PWR_LED_G
  Top 0.305: JP6.25 40.96,6.17 40.89,6.17 40.89,10.67 41.66,11.43 RA10.P$11
SOCK_PWR_LED_R
  Top 0.305: JP6.23 35.81,6.1 35.81,8.38 36.65,9.07 RA9.P$11
SOCK_ROTA
  Top 0.305: JP6.2 9.14,7.62 10.67,9.14 10.67,11.58 RA5.P$11
SOCK_ROTB
  Top 0.305: JP6.4 12.34,8.02 RA5.P$33
SOCK_ROTSW
  Top 0.305: JP6.1 9.14,5.86 10.46,6.92 10.46,7.93 11.43,8.89 11.43,11.54 RA5.P$22 11.48,11.84
SOCK_SPI_CLK
  Top 0.305: JP6.16 26.92,8.89 27.94,9.91 27.94,11.54 RA8.P$22
SOCK_SPI_MOSI
  Top 0.305: JP6.18 29.65,7.55 RA8.P$44
SOCK_WIFI_LED_B
  Top 0.305: JP6.24 37.45,7.77 RA9.P$22
SOCK_WIFI_LED_G
  Top 0.305: RA9.P$33 38.39,11.5 38.39,8.6 JP6.26 39.62,7.25
SOCK_WIFI_LED_R
  Top 0.305: JP6.28 42.53,7.51 RA10.P$22
SPI_CLK  (via drill 0.35, 0.75)  (3 unrouted)
  Top 0.254: 76.71,3.3 75.82,2.16 73.66,2.16 72.9,2.79 72.9,12.19 67.82,17.27 v57.91,17.27 53.45,17.27 47.5,23.74 47.5,37.08 46.2,38.38 U$23.21 34.06,38.38 31.75,36.07 30.35,36.07 29.21,34.8 29.21,34.54 27.69,33.02 26.16,33.02 25.53,32.39 25.53,31.24 24.13,31.24 23.88,30.99 v23.88,30.48
  Top 0.305: U$24.D5 76.71,3.3 | RA8.P$2 28.05,13.82 29.72,15.49 29.72,17.27 SPI.3 27.18,19.81 26.42,19.81
  Bottom 0.305: 14.99,30.48 v23.88,30.48
SPI_MISO  (via drill 0.35, 0.75)  (2 unrouted)
  Top 0.254: U$23.22 36.21,38.86 33.53,38.86 31.24,36.58 30.23,36.58 27.69,34.04 26.16,34.04 v24.13,32
  Top 0.305: U$24.D6 74.17,12.19 67.82,18.54 v60.71,18.54 53.34,18.54 48.01,24.13 48.01,37.34 46.48,38.86 39.52,38.86 U$23.22
  Bottom 0.305: 14.99,32 v24.13,32
SPI_MOSI  (via drill 0.35, 0.75)  (3 unrouted)
  Top 0.254: U$24.D7 71.63,2.54 72.39,1.65 76.96,1.65 77.98,2.54 77.98,9.65 68.33,19.81 v57.91,19.81 53.23,19.81 48.51,24.52 48.51,37.59 46.74,39.37 U$23.23 33.02,39.37 30.73,37.08 30.1,37.08 28.07,35.05 26.16,35.05 v25.4,34.29
  Top 0.305: RA8.P$4 32.04,13.25 32.51,13.72 32.51,18.03 32,18.54 SPI.1 30.99,19.56 30.23,20.32 26.67,20.32
  Bottom 0.305: 14.99,34.29 v25.4,34.29 v25.4,30.48
SWCLK
  Top 0.305: U$23.49 20.62,43.89 19.81,44.7 19.81,63.75 20.32,64.26 SWD1.2
SWDIO
  Top 0.305: U$23.46 31.04,50.75 29.97,51.82 29.97,58.67 29.46,59.18 SWD1.4
SWO
  Top 0.305: U$23.55 28.96,40.89 29.46,41.4 29.46,43.94 27.18,46.23 27.18,53.85 26.92,54.1 SWD1.6
USB12V
  Top 0.813: D2.C 90.42,49.78
  Top 1.016: SJ5.2 SJ6.2 90.42,58.67 | SJ3.1 90.42,49.78 90.42,52.32 | 90.42,52.32 90.42,58.67 | 90.42,58.67 LM317.3 87.56,58.74 R1.2 | D1.A 90.42,52.32
USBGND  (via drill 0.35)
  other vias: 83.82,78.74 86.36,78.74 88.9,78.74 99.06,78.74 91.44,73.15 93.98,73.15 87.88,68.33 85.09,55.88 85.09,53.34 86.36,48.26 83.82,48.26 93.98,48.26 96.52,48.26 101.6,60.96 101.6,66.04 87.63,55.88 87.63,53.34
  pour Bottom: 81.53,80.01 100.84,80.01 104.65,61.21 105.66,45.21 105.66,44.96 81.53,45.21
  pour Top: 81.53,80.01 100.84,80.01 104.65,61.21 105.66,45.21 105.66,44.96 81.53,45.21
USBVBUS
  Top 0.813: C3.1 92.64,68.83 93.73,68.83 95.76,70.87 95.76,73.41 98.3,75.95 SJ12.1 | SJ13.1 SJ9.2 SJ8.2 97.03,60.2 SJ14.1
  Top 1.016: LM317.1 87.63,65.53 88.65,66.55 SJ6.1 SJ5.1 | D1.C 93.47,62.48 94.74,63.75 94.74,65.79 | 94.74,65.79 93.98,66.55 SJ5.1 | SJ5.1 C3.1 | SJ13.1 96.77,65.79 94.74,65.79
V3.3  (via drill 0.35, 0.45, 0.75)  (7 unrouted)
  Top 0.305: U$23.13 36.04,35.28 36.32,35.56 39.88,35.56 40.13,35.31 C11.1 | U$24.V3.3 58.93,4.83 57.98,5.78 C14.1 55.95,5.33 55.12,5.33 53.85,4.06 v53.85,1.78 | U$23.64 27.48,36.37 v26.92,35.81 C1.1 | 69.6,25.21 C16.1 | 40.39,54.62 U1.24 | U1.24 U1.23 | v70.36,21.08 81.47,9.72 C15.1 81.47,7.94 81.79,7.62 U$24.V3.3@1 v81.79,1.52 | v69.6,23.37 69.6,25.21 | SJ10.2 51.05,43.69 47.24,43.69 46.48,44.45 46.48,46.74 45.97,47.24 44.7,47.24 | 44.7,47.24 v40.89,47.24 40.64,47.24 39.37,45.97 39.37,44.02 U$23.32 38.52,43.89 38.35,43.72 35.02,43.72 34.29,44.45 30.6,44.45 30.02,45.02 U$23.48 30.02,46.69 29.21,47.5 C7.1 | 44.7,47.24 C8.1 | U$23.19 43.13,37.39 43.43,37.08 C6.1 | U1.24 40.4,50.82 v40.39,50.8 | U$24.V3.3@2 69.09,26.42 69.6,25.91 69.6,25.21 | U$21.VCC 13.97,67.31 14.48,66.8 SWD1.1 26.42,66.8 26.92,66.29 26.92,63.5 26.42,62.99 21.84,62.99 21.34,62.48 R11.1 | U$23.1 30.02,33.83 29.46,33.27 v28.96,33.27
  Top 0.61: U$15.VOUT 73.41,36.58 | U$24.V3.3@2 65.02,33.53 65.02,43.18 | 65.02,43.18 72.14,43.18 73.41,41.91 | 65.02,43.18 SJ10.2 | 2.79,49.02 2.03,48.26 2.03,22.1 3.05,21.08 JP8.1 8.13,21.08 9.11,20.1 9.11,10.7 6.6,8.19 6.6,3.24 7.56,2.29 7.62,2.29 7.87,2.03 v14.22,2.03 | 2.79,49.02 JP7.1 | U$22.VCC 33.02,76.97 31.5,78.49 16.51,78.49 13.97,75.95 | 13.97,75.95 U$21.VCC | 2.79,49.02 1.78,50.04 1.78,67.63 5.27,71.12 7.87,71.12 9.91,73.15 9.91,74.68 11.3,76.07 13.84,76.07 13.97,75.95 | 68.07,43.18 68.33,43.43 v68.33,44.2
  Top 0.813: U$15.VOUT 73.41,41.91 U$15.VOUTB C10.1
  Bottom 0.305: JP6.14 22.91,5.89 16.32,5.89 15.25,4.83 JP6.5 | v70.36,21.08 69.6,21.84 v69.6,23.37 | v40.39,50.8 40.89,50.29 v40.89,47.24
  Bottom 0.61: v26.92,35.81 26.92,32 | v14.22,2.03 JP6.5
V5  (via drill 0.35, 0.45, 0.75, 1)
  Top 0.152: 40.4,61.45 v40.39,61.47
  Top 0.305: v11.43,74.17 11.43,72.14 11.68,71.88 | v30.48,71.88 v30.48,74.17
  Top 0.61: 75.18,35.81 U$15.VIN 75.71,36.84 74.42,35.56 68.07,35.56 v66.55,34.04 | v12.45,71.88 11.68,71.88 9.14,69.34 JP7.9 5.84,69.34 4.83,68.33 4.83,51.31 5.84,50.29 9.14,50.29 9.65,49.78 9.65,41.91 9.14,41.4 JP8.9 4.57,41.4 3.81,40.64 3.81,23.37 4.83,22.35 8.64,22.35 9.91,21.08 9.91,9.91 7.62,7.62 7.62,4.06 8.64,3.05 33.78,3.05 34.54,3.81 | v30.48,71.88 34.04,71.88 34.29,72.14 34.29,75.69 34.8,76.2 50.55,76.2 52.32,74.42 U$13.16 52.32,65.53 51.56,64.77 v40.39,64.77 | SJ11.2 53.85,33.53 v54.1,33.27 | U$24.V5 56.96,29.46 C5.1 55.31,29.14 54.61,28.45 v54.61,23.37 | U1.1 40.4,61.45 | 34.54,3.81 JP6.21 JP6.20 | 34.54,3.81 34.8,3.81 35.56,3.05 46.99,3.05 48.01,4.06 | JP6.30 48.01,4.06 | 48.01,4.06 54.61,10.67 v54.61,16
  Top 0.813: 80.26,35.81 C9.1 79.18,36 79.25,36.07 v79.25,38.35
  Top 1.016: 75.18,35.81 80.26,35.81 U$16.VO
  Bottom 0.61: v12.45,71.88 v30.48,71.88 | v40.39,61.47 v40.39,64.77 | v66.55,34.04 64.52,32 60.96,32 60.45,31.5 58.93,31.5 | v54.1,33.27 56.39,33.27 58.42,31.5 58.93,31.5 | 58.93,31.5 U$24.V5 | v54.61,23.37 v54.61,16
V12  (via drill 0.75)
  Top 0.508: J2.3 91.49,36.07 v88.9,36.07
  Top 0.813: 88.71,40.89 C2.1 | 90.42,41.15 90.17,40.89
  Top 1.016: U$13.8 71.88,60.45 78.49,54.1 78.49,44.45 80.52,42.16 83.31,42.16 U$16.VI 88.71,40.89 90.17,40.89 | SJ3.2 90.42,41.15 91.95,39.37 91.95,37.13 J2.3
VADJ
  Top 0.813: 83.75,60.89 R1.1 | 84.14,61.21 84.07,61.28 | 85.85,70.87 85.85,71.12
  Top 1.016: R1.1 84.14,61.21 LM317.2 | D2.A 82.8,59.94 83.75,60.89 | 84.07,61.28 84.07,66.55 85.85,68.33 85.85,70.87 86.11,71.12 89.34,71.12 C4.1 | 85.85,71.12 85.34,71.63 R2.2
VBUS
  Top 0.813: JP2.4 JP2.2 100.08,73.66 SJ12.2
VBUS_A
  Top 1.016: JP1.4 98.3,48.51 96.01,50.8 SJ14.2
VCAP
  Top 0.305: U$23.30 40.84,42.88 41.66,43.69 42.35,43.69 C12.1
VCONN
  Top 1.016: SJ13.2 100.33,67.31 JP2.6
VCONNA
  Top 1.016: SJ9.1 103.12,63.25 103.63,62.48 103.63,46.48 103.12,45.97 JP1.1
VDD
  Top 0.813: JP1.12 98.55,58.93 SJ8.1
VLT_DIR  (via drill 0.35)
  Top 0.305: U$23.36 36.04,47.22 38.86,50.04 41.15,50.04 41.66,50.55 v41.66,56.39 | v41.66,59.69 41.66,61.72 41.15,62.23 39.88,62.23 39.62,61.98 39.62,60.3 U1.2
  Bottom 0.305: v41.66,56.39 v41.66,59.69
WIFI_CS  (via drill 0.75)
  Top 0.254: U$24.D8 69.09,3.56 71.25,1.14 78.61,1.14 80.52,2.79 80.52,8.89 68.58,21.08 v60.71,21.08 53.09,21.08 49.02,25.15 49.02,41.15 48.29,41.89 U$23.28
  Top 0.305: U$24.D8 69.09,3.81
WIFI_GPIO  (via drill 1 pad 1.6)
  Bottom 0.305: U$24.D1 v91.95,10.16
WIFI_IRQ  (via drill 0.75, 1 pad 1.6)
  Top 0.305: 39.47,42.42 U$23.29 48.54,42.39 49.53,41.4 49.53,25.65 52.83,22.35 v57.91,22.35 70.36,22.35 83.06,9.65 83.06,2.79 83.82,2.03 93.98,2.03 94.49,2.54 U$24.D0
  Bottom 0.305: U$24.D0 v94.49,10.16

### Text on the board
tPlace: MTR_OUT_B2 | MTR_OUT_B1 | MTR_OUT_A2 | MTR_OUT_A1 | V5 | GND | VDD_TARGET | SWCLK | NFC_IRQ_NFC0 | GND | SWDIO | NFC_SEL_NFC0 | SPI_MOSI | NRST | SWO | SPI_MISO | SPI_CLK | V3.3 | V3.3 | V5 | GND | V5 | V12 | NFC_IRQ_NFC1 | G | NFC_SEL_NFC1 | SPI_MOSI | SPI_MISO | SPI_CLK | V3.3 | PR | WG | WR | WB | PG | PB
bPlace: IRQ | CS | MOSI | MISO | SCLK